# Altium schematic sheet Modulo Micro Starter.SchDoc
size A4; SheetNumber: 1; SheetTotal: 1
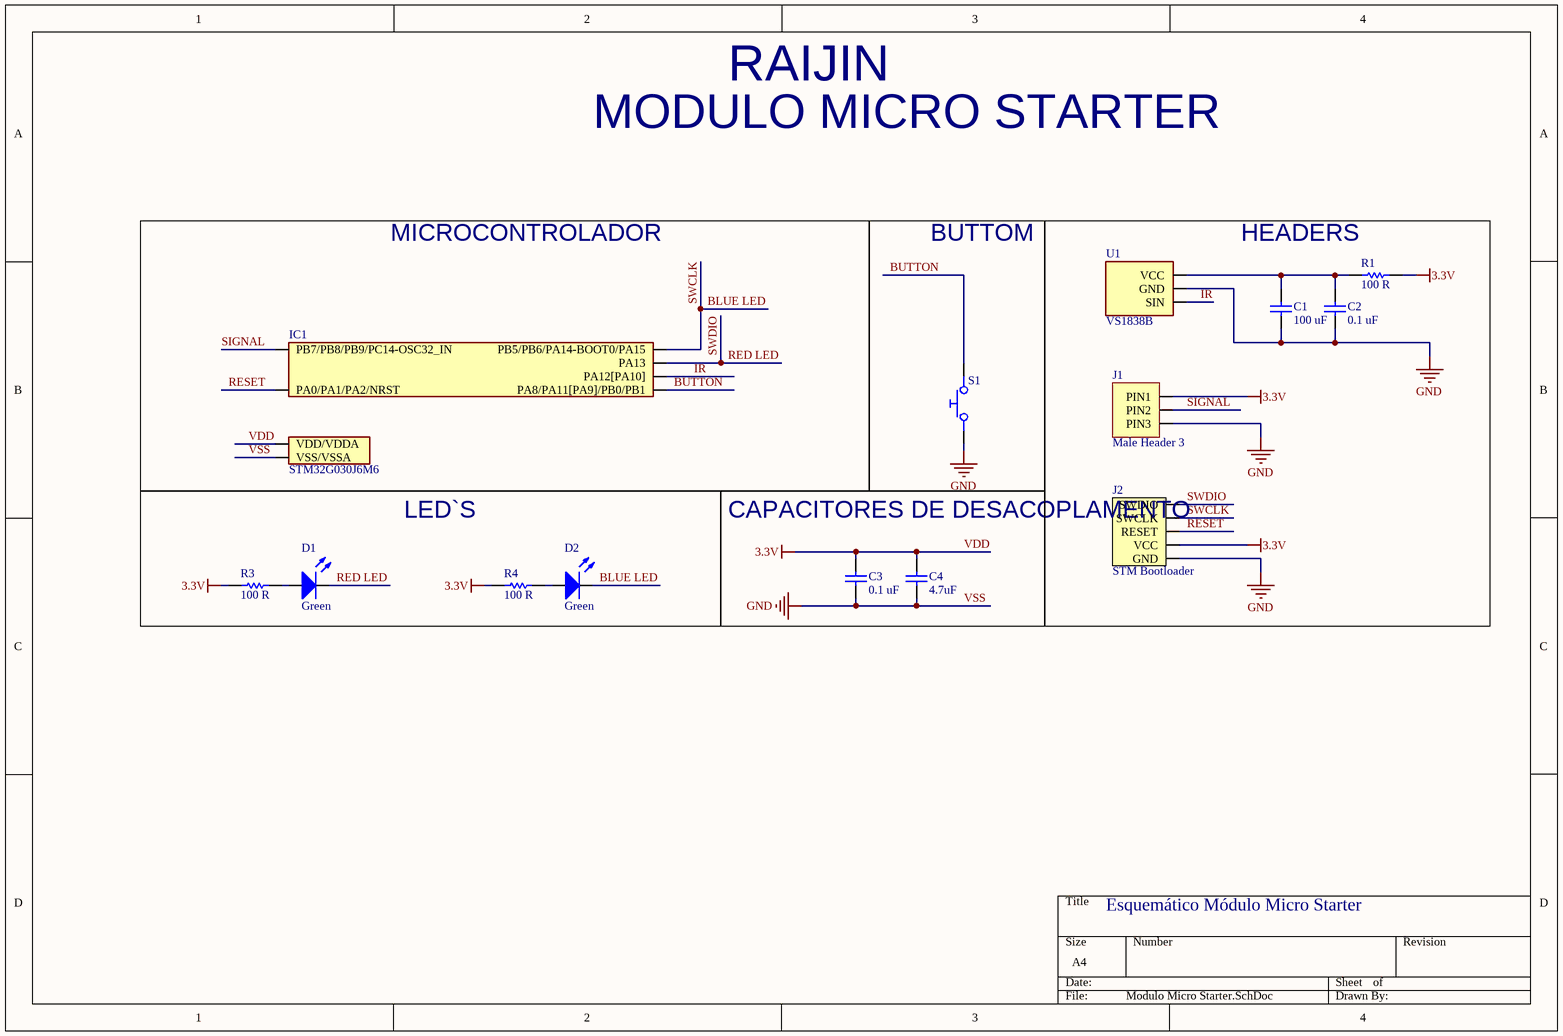
[diagram p0: Modulo Micro Starter.SchDoc]

## Parts
C1  100 uF  [C0805]
C2  0.1 uF  [C0603]
C3  0.1 uF  [C0603]
C4  4.7uF  [C0603]
D1  Green  [LED_0603]
D2  Green  [LED_0603]
IC1  STM32G030J6M6  [SO8N]
J1  Male Header 3  [MALE HEADER 3]
J2  STM Bootloader  [STM BOOTLOADER]
R1  100 R  [RESISTOR_0603]
R3  100 R  [RESISTOR_0603]
R4  100 R  [RESISTOR_0603]
S1  PTS540JK035SMTRLFS  [PUSH_BUTTON]  (value not drawn)
U1  VS1838B  [FEMALE HEADER 3]

## Blocks framed on the sheet
MICROCONTROLADOR: IC1
BUTTOM: S1
HEADERS: C1 C2 J1 J2 R1 U1
LED`S: D1 D2 R3 R4
CAPACITORES DE DESACOPLAMENTO: C3 C4

## Nets
VDD: C3.2 C4.2 IC1.2(VDD/VDDA) J1.PIN1 J2.VCC R1.2 R3.1 R4.1  [also labelled 3.3V]
VSS: C1.1 C2.1 C3.1 C4.1 IC1.3(VSS/VSSA) J1.PIN3 J2.GND S1.1 U1.PIN2(GND)  [also labelled GND]
BLUE LED: D2.C IC1.8(PB5/PB6/PA14-BOOT0/PA15) J2.CLK(SWCLK)  [also labelled SWCLK]
BUTTON: IC1.5(PA8/PA11[PA9]/PB0/PB1) S1.2
IR: IC1.6(PA12[PA10]) U1.PIN3(SIN)
RED LED: D1.C IC1.7(PA13) J2.DIO(SWDIO)  [also labelled SWDIO]
RESET: IC1.4(PA0/PA1/PA2/NRST) J2.RESET
SIGNAL: IC1.1(PB7/PB8/PB9/PC14-OSC32_IN) J1.PIN2
NetC1_2: C1.2 C2.2 R1.1 U1.PIN1(VCC)
NetD1_A: D1.A R3.2
NetD2_A: D2.A R4.2

## Notes on the sheet
- RAIJIN
- MODULO MICRO STARTER
- Esquemático Módulo Micro Starter

## Library data of the parts
C1 = JMK212BBJ107MG-TE: CAP CER 100UF 6.3V X5R 0805; Manufacturer: TAIYO YUDEN; Part Number: JMK212BBJ107MGTE; Tolerance: 20%; Library Control - Checked Footprint: Yes; Library Control - Person that Checked Footprint: Nikaum; Supplier 1: MOUSER; Category: Ceramic Capacitor; Price: 1= 1,81, 10= 1,32, 100= 1,05 (USD); Supplier Part Number 1: 963-JMK212BBJ107MGTE; Library Ref: Capacitor; Operating Temperature: -55 C ~ 85 C; Package / Case: 0805 (2012 Metric); Size / Dimension: 2,00 L x 1,25 W x 1,45 H; Value: 100 uF; Voltage - Rated: 6.3V; ESR: -; Dieletric: X5R; Library Control - Checked Schematic: Yes; Library Control - Last Update: 28/06/2021 00:45; Library Control - Person that Checked Schematic: Nikaum; Library Control - Person that did the Last Update Footprint: Nikaum; Library Control - Person that did the Last Update Schematic: Nikaum; ComponentLink1Description: Datasheet; ComponentLink1URL: https://ds.yuden.co.jp/TYCOMPAS/ut/detail?pn=JMK212BBJ107MG-TE&u=M; ComponentLink2Description: Mouser Link; ComponentLink2URL: https://br.mouser.com/ProductDetail/Taiyo-Yuden/JMK212BBJ107MG-TE?qs=%2Fha2pyFadujnrq1V71i9DT3lBuRfsdZxICgBGkmgMyDSXYhp4%252BfygEm2aQR9aTWJ
C2 C3 = GRM188R71E104KA01D: CAP CER 0.1uF 25V X7R 0603; Manufacturer: Murata Electronics; Tolerance: 10%; Voltage - Rated: 25 VDC; ESR: 100 mΩ; Library Control - Checked Footprint: Yes; Library Control - Person that Checked Footprint: Nikaum; Library Control - Person that did the Last Update Footprint: Raquel; Supplier 1: Mouser; Part Number: GRM188R71E104KA01D; Category: Ceramic Capacitors; Price: -; Supplier Part Number 1: 81-GRM39X104K25; Library Ref: Capacitor; Operating Temperature: -55 C ~ 125 C; Package / Case: 0603 (1608 Metric); Size / Dimension: 1,60 L x 0,80 W x 0,80 H; Value: 0.1 uF; Dieletric: X7R; Library Control - Checked Schematic: Yes; Library Control - Last Update: 28/06/2021 00:22; Library Control - Person that Checked Schematic: Nikaum; Library Control - Person that did the Last Update Schematic: Nikaum; ComponentLink1Description: Datasheet; ComponentLink1URL: https://br.mouser.com/datasheet/2/281/murata_03052018_GRM_Series_1-1310166.pdf; ComponentLink2Description: Mouser Link; ComponentLink2URL: https://br.mouser.com/ProductDetail/Murata-Electronics/GRM188R71E104KA01D?qs=%2Fha2pyFaduiZGTXBCPzk%2FmTbMtAE8bS6%252BO3gVgb8hKBi1xePxGtiOg%3D%3D
C4 = CC0603KRX5R8BB475: CAP CER 4.7uF 25V X5R 0603; Manufacturer: Yageo; Tolerance: 10%; ESR: 0.05; Library Control - Checked Footprint: Yes; Library Control - Person that Checked Footprint: Nikaum; Supplier 1: Mouser; Part Number: CC0603KRX5R8BB475; Category: Ceramic Capacitor; Price: 1=0.25, 10=0.164, 100=0,093 (USD); Supplier Part Number 1: 603-CC0603KRX58BB475; Library Ref: Capacitor; Operating Temperature: -55 C ~ 125 C; Package / Case: 0603 (1608 Metric); Size / Dimension: 1,60 L x 0,80 W x 0,87 H; Value: 4.7uF; Voltage - Rated: 25V; Dieletric: X5R; Library Control - Checked Schematic: Yes; Library Control - Last Update: 27/06/2021 23:47; Library Control - Person that Checked Schematic: Nikaum; Library Control - Person that did the Last Update Footprint: Nikaum; Library Control - Person that did the Last Update Schematic: Nikaum; ComponentLink1Description: Datasheet; ComponentLink1URL: https://br.mouser.com/datasheet/2/447/yago_s_a0011397150_1-2286655.pdf; ComponentLink2Description: Mouser Link; ComponentLink2URL: https://br.mouser.com/ProductDetail/Yageo/CC0603KRX5R8BB475?qs=%2Fha2pyFaduh%2F7Q8z%252B7Ot0eflSx5gYDgPHryPFxzpgCUeMwc25ZtPlNgXae48%252BTjy
D1 D2 = 150060VS75000: LED 0.072W GREEN 40MCD 0603; Manufacturer: Wurth Elektronik; Current - Forward (If): 20 mA; Voltage - Forward (Vf): 2 V; Viewing Angle: 140°; Wavelength: 570nm; Max Power Dissipation: 72mW; Max Current Rating: 100mA; Reverse Voltage:: 5V; Library Control - Last Project that Used: Diodo/Led; Library Control - Person that Checked Footprint: Nícolas; Library Control - Person that did the Last Update Footprint: Marcos; Supplier 1: Mouser; Manufacturer Part Number: 150060VS75000; Category: Standard LEDs - SMD; Price: 1 = 0.15, 50 = 0.138, 100 = 0.118 (USD); Package / Case: 0603; Color: Green; Operating Temperature: -40~85 °C; Luminous Intensity: 40 mcd; Library Ref: LED; Supplier Part Number 1: 710-150060VS75000; Library Control - Checked Footprint: 25/07/2021; Library Control - Checked Schematic: 25/07/2021; Library Control - Last Update: 06/08/2021; Library Control - Person that Checked Schematic: Nícolas; Library Control - Person that did the Last Update Schematic: Marcos; ComponentLink1Description: Mouser Link; ComponentLink1URL: https://br.mouser.com/ProductDetail/Wurth-Elektronik/150060VS75000?qs=%2Fha2pyFaduhuT%2FKGSijZP0vTyJZ9U993KfsBQSxqATYhY9jnc2c09tXoMoJ3wn4L; ComponentLink2Description: Datasheet Link; ComponentLink2URL: https://br.mouser.com/datasheet/2/445/150060VS75000-1714627.pdf
IC1 = STM32G030J6M6: IC MCU 32-BIT 8kB FLASH ARM Cortex M0+ 64MHZ  SO8N; Manufacturer: STM; Number of I/Os: 5; Oscillator Type: Internal; Program Memory Size: 64kB; Peripherals: ADC, Timer, DMA; Voltage - Supply (Vcc/Vdd): 2 V to 3.6 V; Number of Timers/Counters: 2; Number of ADC Channels: 4; Number of SPI Channels: 3; Number of I2C Channels: 1; Library Control - Person that did the Last Update Footprint: Marcos; Supplier 1: Mouser; Part Number: STM32G030J6M6; Category: ARM Microcontrollers - MCU; Price: 1 = 1,46, 10 = 1,31,  100 = 1,02, 1000 = 0,665 (USD); Package/Case: SO8N; Operating Temperature: -40°C to 85°C; Connectivity: -; Speed: 64MHz; Program Memory Type: Flash; Core Processor: ARM Cortex M0+; RAM Size: 8k B; Core Size: *; Number of UART/USART Channels: 1; Number of Ethernet Channels: -; Series: STM32G0; Library Ref: Microcrontrollers; Supplier Part Number 1: 511-STM32G030J6M6; Library Control - Checked Footprint: *; Library Control - Checked Schematic: *; Library Control - Last Project that Used: *; Library Control - Last Update: *; Library Control - Person that Checked Footprint: *; Library Control - Person that Checked Schematic: *; Library Control - Person that did the Last Update Schematic: Marcos; ComponentLink1Description: Mouser Link; ComponentLink1URL: https://www.mouser.com/ProductDetail/STMicroelectronics/STM32G030J6M6?qs=uwxL4vQweFMe%2Fiu4dY6izA%3D%3D; ComponentLink2Description: Datasheet Link; ComponentLink2URL: https://www.mouser.com/datasheet/2/389/dm00613878-1799578.pdf
J1 = Male Header 3: Number of Contacts: 3; Library Control - Person that did the Last Update Schematic: Guilherme; System: Connector; Library Ref: Header; Library Control - Checked Footprint: *; Library Control - Checked Schematic: *; Library Control - Last Project that Used: *; Library Control - Last Update: *; Library Control - Person that Checked Footprint: *; Library Control - Person that Checked Schematic: *; Library Control - Persont that did the Last Update Footprint: Guilherme
J2 = Barramento de Gravação STM: BARRAMENTO DE GRAVAÇÃO; Number of Contacts: 5; Library Ref: Header
R1 R3 R4 = RC0603FR-10100RL: RES SMD 100 OHM 1% 1/10W 0603; Manufacturer: Yageo; Temperature Coefficient: 100 PPM / C; Power Rating: 100mW (1/10W); Voltage Rating: 75 V; Library Control - Checked Footprint: Yes; Library Control - Person that Checked Footprint: Nikaum; Library Control - Person that did the Last Update Footprint: Nicolas; Supplier 1: Mouser; Part Number: RC0603FR-10100RL; Category: Thick Film Resistors - SMD; Price: 1 = 0,10, 10 = 0,018, 100 = 0,006 (USD); Package / Case: 0603 (1608 metric); Operating Temperature: - 55 C~155 C; Value: 100 R; Tolerance: 1 %; Library Ref: Resistor; Resistor Type: Fixo; Size / Dimension: 1,60 L x 0,80 W x 0,45 H; Supplier Part Number 1: 603-RC0603FR-10100RL; Library Control - Checked Schematic: Yes; Library Control - Last Update: 27/06/2021 21:11; Library Control - Person that Checked Schematic: Nikaum; Library Control - Person that did the Last Update Schematic: Nikaum; ComponentLink1Description: Mouser Link; ComponentLink1URL: https://br.mouser.com/ProductDetail/Yageo/RC0603FR-10100RL/?qs=EiqXWrxQq62RG9T9SdQg0g==; ComponentLink2Description: Datasheet Link; ComponentLink2URL: https://br.mouser.com/datasheet/2/447/Yageo_03_18_2021_PYu_RC_Group_51_RoHS_L_11-2199992.pdf
S1 = Push Button: TACTILE SWITCH SPST 0.05A 12VDC SMD; Manufacturer: C&K Switches; Voltage Rating (DC): 12V; Current Rating: 50mA; Switch Function: Off-On; Operating Force: 230gf; Library Control - Checked Footprint: Yes; Library Control - Person that Checked Schematic: Nícolas; Bounce time (MAX): 10ms; ComponentLink1Description: Datasheet; ComponentLink1URL: https://www.mouser.com/datasheet/2/60/pts540-1841856.pdf; ComponentLink2Description: Mouser Link; ComponentLink2URL: https://www.mouser.com/ProductDetail/CK/PTS540JK035SMTRLFS?qs=nsc5Ve2%252BdoHscnqTjIh87g%3D%3D; Supplier 1: Mouser; Part Number: PTS540JK035SMTRLFS; Category: Tactile Switches; Pricing 1: 1=0,18, 10=0,174, 100=0,15, 500=0,122, 1000=0,103 (USD); Throw Configuration: SPST; Orientation: Straight; Supplier Part Number 1: 611-PTS540JK035SMTRL; Library Ref: Diversos; Library Control - Checked Schematic: Yes; Library Control - Person that Checked Footprint: Nícolas; Library Control - Person that did the Last Update Schematic: Nícolas
U1 = VS1838B: INFRARED RECEIVER MODULE; Sensitivity: +/- 45°; Output Type: Digital; Operating Supply Current: 0.4 mA; Supply Voltage (Min - Máx): (2.7 - 5.5)V; Library Control - Person that did the Last Update in Footprint: Marcos; ComponentLink1Description: Datasheet; ComponentLink1URL: https://datasheetspdf.com/pdf-file/700398/ETC/VS1838B/1; ComponentLink2Description: Mouser Link; ComponentLink2URL: -; Part Number: VS1838B; Sensor Type: Infrared; Price: -; Package / Case: -; Operating Temperature (Min - Máx): -20~80 °C; Supplier 1: -; Manufacturer: -; Library Ref: Diversos; Library Control - Last Update: 06/08/2021; Library Control - Person that did the Last Update in Schematic: Marcos